# Altium schematic sheet MercurialSDR_PWR.SchDoc: p2020 v1
size A4; Author: RF-Lab; DrawnBy: RF-Lab; Revision: Rev1.0; SheetNumber: 2; SheetTotal: 6
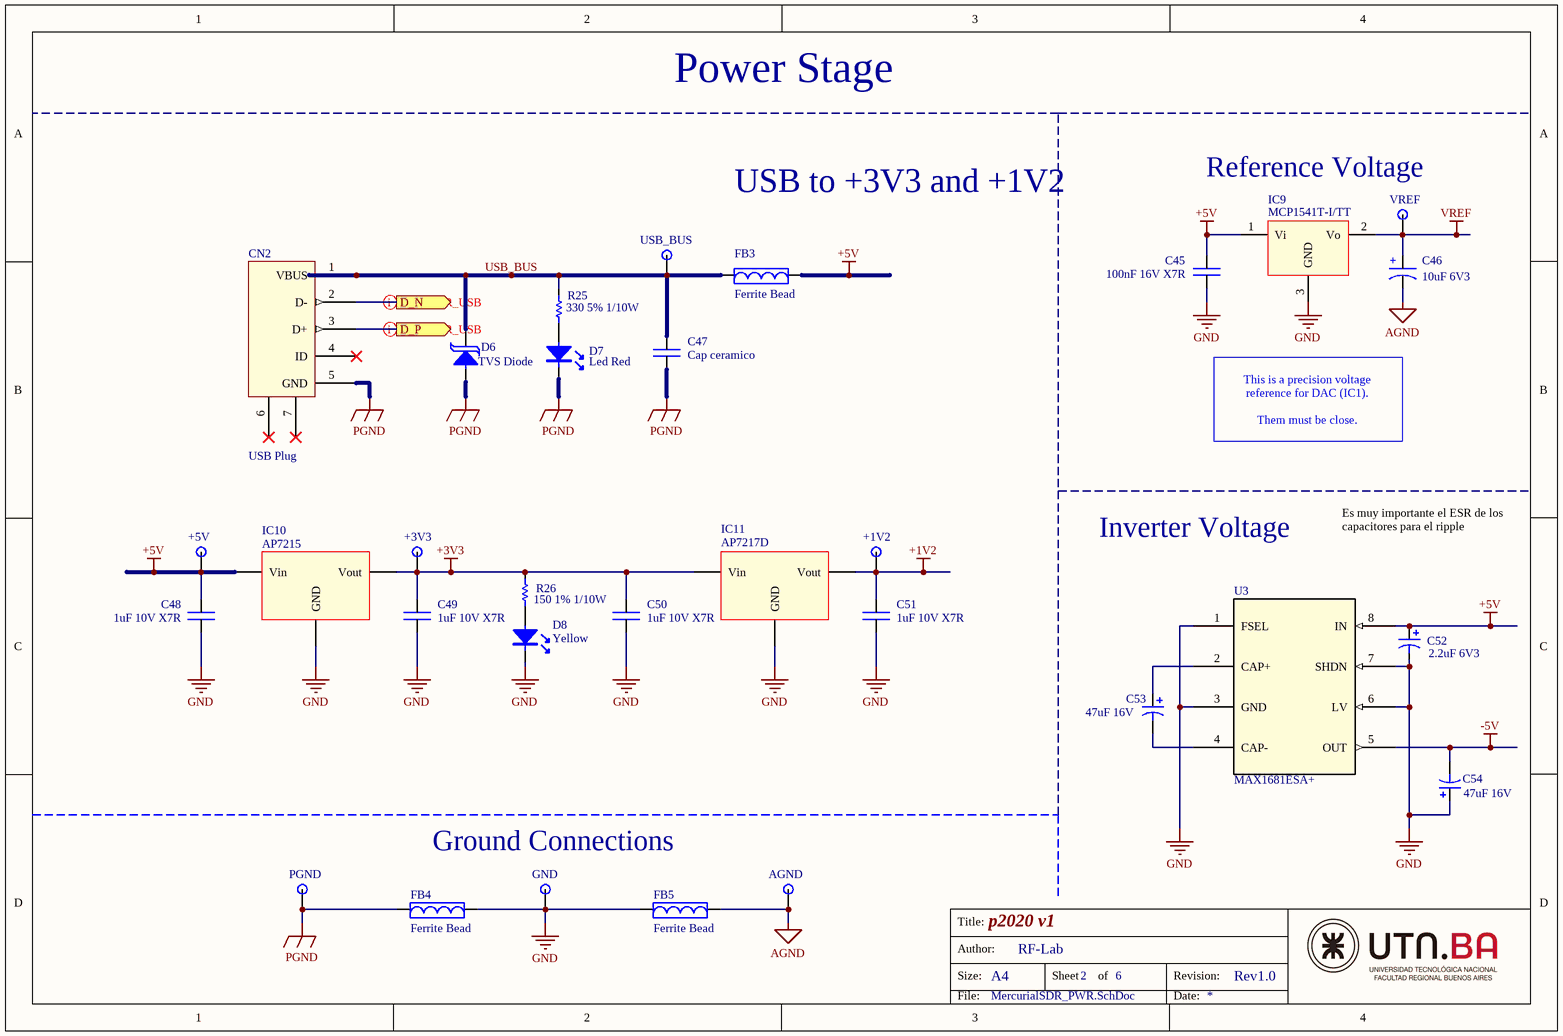
[diagram p0: MercurialSDR_PWR.SchDoc]

## Parts
C45  value 100nF 16V X7R  [CAP_0603]  (hidden comment: 100nF 16V X7R - CL10B104KO8NNNC)
C46  value 10uF 6V3  [CAP_TANT_1206]  (hidden comment: 10uF 6V3 - TAJA106K006RNJ)
C47  value Cap ceramico  [CAP_0603]  (hidden comment: 10nF 16v X7R  - CC0603KRX7R7BB103)
C48  value 1uF 10V X7R  [CAP_0603]  (hidden comment: 1uF 10V X7R - CL10B105KP8NNNC)
C49  value 1uF 10V X7R  [CAP_0603]  (hidden comment: 1uF 10V X7R - CL10B105KP8NNNC)
C50  value 1uF 10V X7R  [CAP_0603]  (hidden comment: 1uF 10V X7R - CL10B105KP8NNNC)
C51  value 1uF 10V X7R  [CAP_0603]  (hidden comment: 1uF 10V X7R - CL10B105KP8NNNC)
C52  value 2.2uF 6V3  [CAP_0603]  (hidden comment: 2.2uF 6V3 -  TMCJ1A225MTRF)
C53  value 47uF 16V  [CAPPC5932X280N]  (hidden comment: 47uF 16V - 595D476X9016C2T)
C54  value 47uF 16V  [CAPPC5932X280N]  (hidden comment: 47uF 16V - 595D476X9016C2T)
CN2  value USB Plug  [54819-0589_MOL]  (hidden comment: 54819-0589)
D6  value TVS Diode  [DO-214AC]  (hidden comment: SMAJ5.0A)
D7  Color: Led Red  [LED_0603]  (hidden comment: LTST-C190KRKT)
D8  Color: Yellow  [LED_0603]  (hidden comment: LTST-C190KSKT)
FB3  value Ferrite Bead  [FERRITE_BEAD_0603]  (hidden comment: BLM18AG121SN1D)
FB4  value Ferrite Bead  [FERRITE_BEAD_0603]  (hidden comment: BLM18AG121SN1D)
FB5  value Ferrite Bead  [FERRITE_BEAD_0603]  (hidden comment: BLM18AG121SN1D)
IC9  MCP1541T-I/TT  [SOT-23-3]
IC10  value AP7215  [SOT89-3L]  (hidden comment: AP7215 - AP7365-33YG-13)
IC11  value AP7217D  [SOT89-3L]  (hidden comment: AP7217D - AP7217D-12YG-13)
R25  value 330 5% 1/10W  [RES_0603]  (hidden comment: 330 5% 1/10W - CR0603-JW-331ELF)
R26  value 150 1% 1/10W  [RES_0603]  (hidden comment: 150 1% 1/10W - CR0603-FX-1500ELF)
TP6  TP Name: VREF  [TP_TH]  (hidden comment: Test Point)
TP7  TP Name: USB_BUS  [TP_TH]  (hidden comment: Test Point)
TP8  TP Name: +5V  [TP_TH]  (hidden comment: Test Point)
TP9  TP Name: +3V3  [TP_TH]  (hidden comment: Test Point)
TP10  TP Name: +1V2  [TP_TH]  (hidden comment: Test Point)
TP11  TP Name: PGND  [TP_TH]  (hidden comment: Test Point)
TP12  TP Name: GND  [TP_TH]  (hidden comment: Test Point)
TP13  TP Name: AGND  [TP_TH]  (hidden comment: Test Point)
U3  MAX1681ESA+  [max1681]

## Ports
D_N (out), D_P (out)

## Nets
+1V2: C51.1 IC11.3(Vout) TP10.1(TP?)
+3V3: C49.1 C50.1 IC10.1(Vout) IC11.2(Vin) R26.1 TP9.1(TP?)
+5V: C45.1 C48.1 C52.1 FB3.2 IC9.1(Vi) IC10.3(Vin) TP8.1(TP?) U3.8(IN)
-5V: C54.2 U3.5(OUT)
AGND: C46.2 FB5.2 TP13.1(TP?)
GND: C45.2 C48.2 C49.2 C50.2 C51.2 C52.2 C54.1 D8.2(K) FB4.2 FB5.1 IC9.3(GND) IC10.2(GND) IC11.1(GND) TP12.1(TP?) U3.1(FSEL) U3.3(GND) U3.6(LV) U3.7(SHDN)
PGND: C47.2 CN2.5(GND) D6.1(A) D7.2(K) FB4.1 TP11.1(TP?)
VREF: C46.1 IC9.2(Vo) TP6.1(TP?)
D_N: CN2.2(D-) ; port D_N
D_P: CN2.3(D+) ; port D_P
USB_BUS: C47.1 CN2.1(VBUS) D6.2(K) FB3.1 R25.1 TP7.1(TP?)
NetC53_1: C53.1 U3.2(CAP+)
NetC53_2: C53.2 U3.4(CAP-)
NetD7_1: D7.1(A) R25.2
NetD8_1: D8.1(A) R26.2

Not connected (* = marked no-connect by the designer): CN2 4(ID)* 6(Shield)* 7(Shield)*

## Layout directives
differential pair: D_N, D_P

## Notes on the sheet
- Power Stage
- (near TP6) Reference Voltage
- USB to +3V3 and +1V2
- This is a precision voltage
  reference for DAC (IC1).
  Them must be close.
- Inverter Voltage
- Es muy importante el ESR de los capacitores para el ripple
- (near TP12) Ground Connections
- Title:
- Size:
- Author:
- A4
- Sheet
- of
- Revision:
- File:
- Date:
- (in symbol Cap Pol) +

## Library data of the parts
C45 C47-C51 = Cap: Capacitor no polarizado
C46 = Cap Pol: Capacitor polarizado
C52-C54 = Cap Pol1: Capacitor Polarizado; Published: 8-Jun-2000; LatestRevisionDate: 17-Jul-2002; LatestRevisionNote: Re-released for DXP Platform.; PackageReference: RB7.6-15; Publisher: Altium Limited; PackageDescription: Polarized Capacitor (Radial); 2 Leads
CN2 = USB Plug: Mini-USB Plug
D6 = TVS_DIODE: TVS Diode (Supresor de transitorios)
D7 = Led
D8 = Led: Led Yellow
FB3 = Ferrite Bead: In: 800mA
FB4 FB5 = Ferrite Bead
IC9 = MCP1541: Reference Voltage; Reference Voltage: 4.096V; Part Number: MCP1541T-I/TT
IC10 = AP7215: Linear Voltage Regulator 3v3
IC11 = AP7217D: Linear Voltage Regulator 1V2
R25 R26 = Res: Resistor
U3 = MAX1681: Voltage converter; Vendor: Maxim Integrated Products; Built_By: EMA_UL_Team; SourceLibrary: Maxim_2011-10-27; Manufacturer_Part_Number: MAX1681ESA+; Copyright: Copyright (C) 2018 Accelerated Designs. All rights reserved; RefDes: RefDes; Type: DEV